# Altium schematic sheet expansion_out.SchDoc
size A
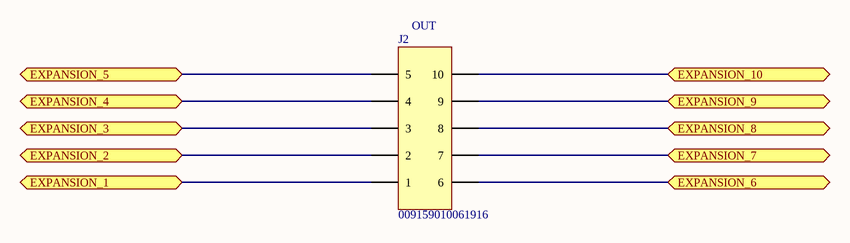
[diagram p0: expansion_out.SchDoc]

## Parts
J2  OUT  [009159010061916_FRONT]

## Ports
EXPANSION_1, EXPANSION_2, EXPANSION_3, EXPANSION_4, EXPANSION_5, EXPANSION_6, EXPANSION_7, EXPANSION_8, EXPANSION_9, EXPANSION_10

## Nets
EXPANSION_1: J2.1 ; port EXPANSION_1
EXPANSION_2: J2.2 ; port EXPANSION_2
EXPANSION_3: J2.3 ; port EXPANSION_3
EXPANSION_4: J2.4 ; port EXPANSION_4
EXPANSION_5: J2.5 ; port EXPANSION_5
EXPANSION_6: J2.6 ; port EXPANSION_6
EXPANSION_7: J2.7 ; port EXPANSION_7
EXPANSION_8: J2.8 ; port EXPANSION_8
EXPANSION_9: J2.9 ; port EXPANSION_9
EXPANSION_10: J2.10 ; port EXPANSION_10

## Library data of the parts
J2 = 009159010061916: CONN SSL BRIDGE 10POS 2MM Open Ended Card Edge: 00-9159; MANUFACTURER: AVX Corporation; VALIDATED BY: NV; DISTRIBUTOR: DIGI-KEY; DISTRIBUTOR P/N: 478-8659-ND; CREATED BY: SO 7 2014; COST: 1.06; MANUFACTURER P/N: 009159010061916